# EAGLE design FET_CAP_v1.2 (EAGLE 8.2.2)
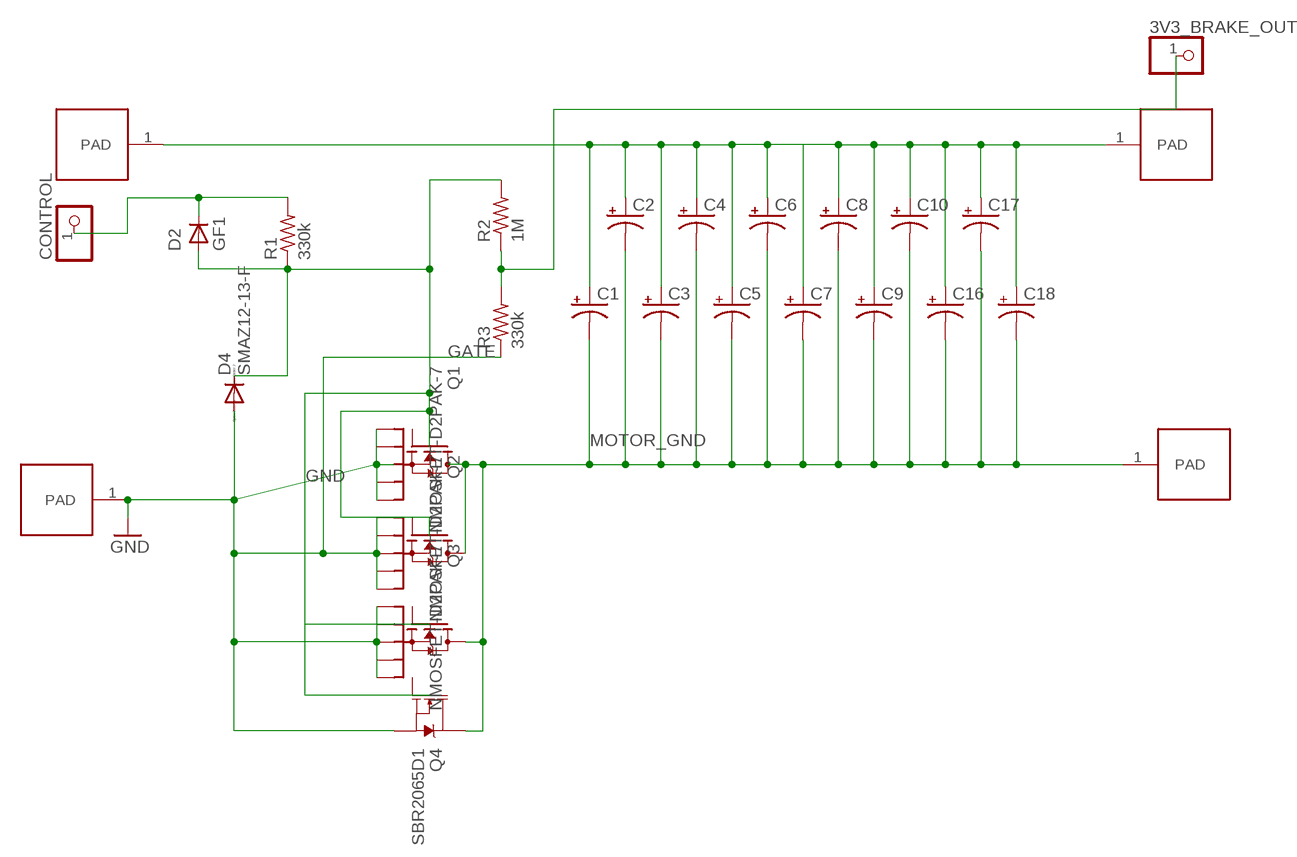
[diagram p0: schematic, sheet 1]

## Parts
3V3_BRAKE_OUT  PINHD-1X1  [1X01]
C1  CPOL-USE3.5-8  [E3,5-8]
C2  CPOL-USE3.5-8  [E3,5-8]
C3  CPOL-USE3.5-8  [E3,5-8]
C4  CPOL-USE3.5-8  [E3,5-8]
C5  CPOL-USE3.5-8  [E3,5-8]
C6  CPOL-USE5-13  [E5-13]
C7  CPOL-USE5-13  [E5-13]
C8  CPOL-USE5-13  [E5-13]
C9  CPOL-USE5-13  [E5-13]
C10  CPOL-USE5-13  [E5-13]
C16  CPOL-USE5-13  [E5-13]
C17  CPOL-USE5-13  [E5-13]
C18  CPOL-USE5-13  [E5-13]
CONTROL  PINHD-1X1  [1X01]
D2  GF1  [SMA-DO214AC]
D4  SMAZ12-13-F  DIODE-DO-214AC  [DO-214AC]
Q1  NMOSFET-D2PAK-7  [D2PAK-7]
Q2  NMOSFET-D2PAK-7  [D2PAK-7]
Q3  NMOSFET-D2PAK-7  [D2PAK-7]
Q4  SBR2065D1  MOSFET-NCH-FDD8780  [DPAK]
R1  330k  R-US_R0603  [R0603]
R2  1M  R-US_R0603  [R0603]
R3  330k  R-US_R0603  [R0603]
U$1  WIRE_SOLDER_PAD  [SOLDER_PAD]
U$2  WIRE_SOLDER_PAD  [SOLDER_PAD]
U$3  WIRE_SOLDER_PAD  [SOLDER_PAD]
U$4  WIRE_SOLDER_PAD  [SOLDER_PAD]

## Nets
3.3V_OUT: 3V3_BRAKE_OUT.1 R2.1 R3.2
GATE: D2.A D4.C R1.1 R2.2
GND: D4.A Q1.S1 Q1.S2 Q1.S3 Q1.S4 Q1.S5 Q2.S1 Q2.S5 Q3.S1 Q3.S5 Q4.3(S) R3.1 U$4.1(PAD)
MOTOR_GND [power]: C1.- C2.- C3.- C4.- C5.- C6.- C7.- C8.- C9.- C10.- C16.- C17.- C18.- Q1.D Q2.D Q3.D Q4.4(D) U$3.1(PAD)
N$2: CONTROL.1 D2.K(C) R1.2
V_BATT [power]: C1.+ C2.+ C3.+ C4.+ C5.+ C6.+ C7.+ C8.+ C9.+ C10.+ C16.+ C17.+ C18.+ U$1.1(PAD) U$2.1(PAD)
Unconnected: Q1.G Q2.G Q2.S2 Q2.S3 Q2.S4 Q3.G Q3.S2 Q3.S3 Q3.S4 Q4.1(G)

## Library data of the parts
3V3_BRAKE_OUT CONTROL = pinhead:PINHD-1X1: PIN HEADER
C1-C10 C16-C18 = rcl:CPOL-US: POLARIZED CAPACITOR, American symbol
D2 = diode:GF1: DIODE
D4 = diode:DIODE-: DIODE
Q1-Q3 = D2PAK-7:NMOSFET-D2PAK-7
Q4 = SparkFun-DiscreteSemi:MOSFET-NCH: N-channel MOSFETs Voltage controlled devices that allow control of high current outputs. SparkFun Products: SparkFun OpenScale <https://www.sparkfun.com/products/13261> SparkFun Digital Sandbox <https://www.sparkfun.com/products/12651> SparkFun Monster Moto Shield <https://www.sparkfun.com/products/10182> SparkFun MOSFET Power Controller <https://www.sparkfun.com/products/11214>; PROD_ID: TRANS-09984; VALUE: 35A/25V/8.5mΩ
R1-R3 = rcl:R-US_: RESISTOR, American symbol
U$1-U$4 = ISCTRainingProgram:WIRE_SOLDER_PAD

## Net classes
1 power: width 1.016 mm

## Board
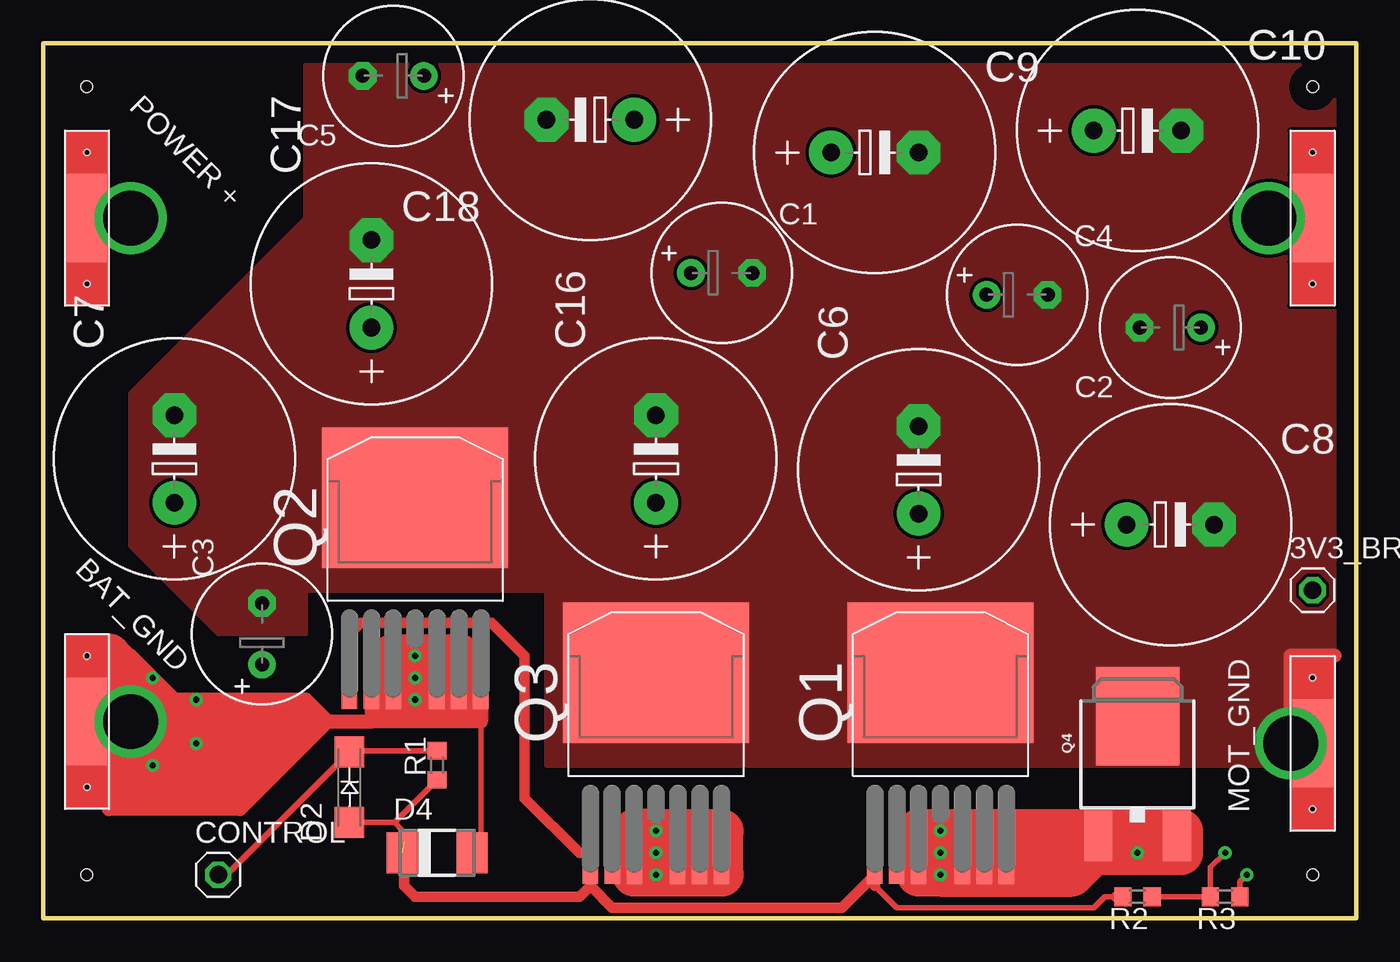
[diagram p1: board, top side]
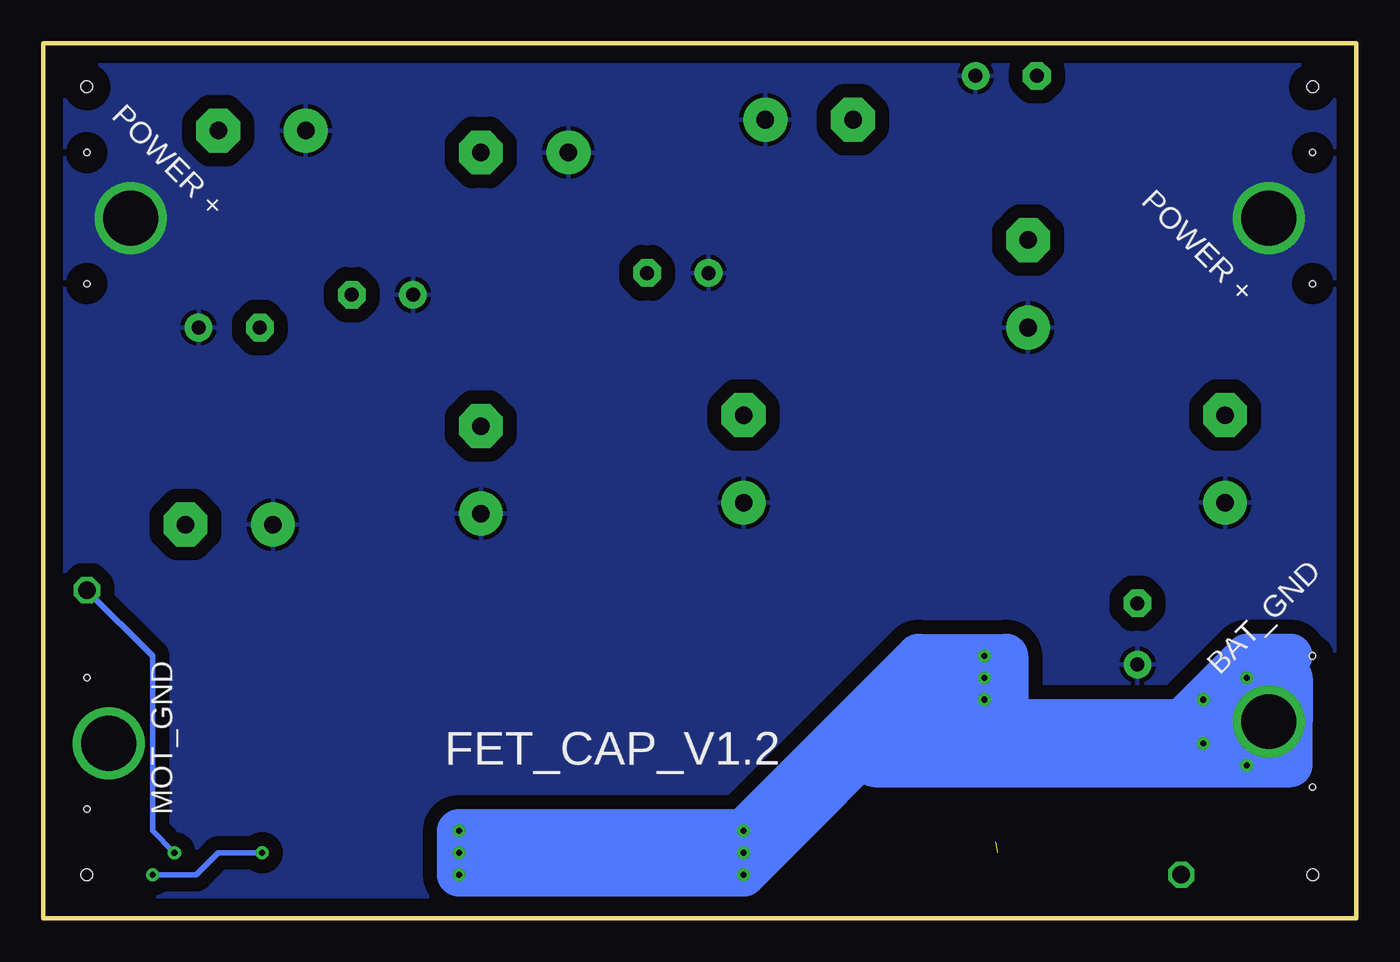
[diagram p2: board, bottom side, seen from below]

Size 76.2 x 50.8 mm. Coordinates in mm from the lower left corner, seen from the top.
Outline: 0,0 0,50.8 76.2,50.8 76.2,0 0,0
Copper layers (1*16): Top 0.035mm / dielectric 1.5mm / Bottom 0.035mm
Design rules "default": minimum track width 10mil, minimum drill 24mil, track to track 8mil, track to pad 8mil, pad to pad 8mil, via to via 8mil, smd to smd 8mil, copper to edge 40mil, drill to drill 8mil, minimum pad ring 10mil, minimum via ring 8mil, stop-mask expansion 4mil, vias tented up to drill 0mil, thermal gap 10mil
Holes 0.65 mm at 2.54,2.54 73.66,2.54 73.66,48.26 2.54,48.26

### Footprints (pad centres in the part's own frame; a part is rotated, then mirrored left to right if it is on the bottom)
1X01 = drill 1.016 octagon: 1 0,0
E3,5-8 = drill 0.813 pad 1.6: + -1.778,0 | drill 0.813 pad 1.6 octagon: - 1.778,0
E5-13 = drill 1.016 pad 2.54: + -2.54,0 | drill 1.016 pad 2.54 octagon: - 2.54,0
SMA-DO214AC = smd 1.8 x 1.7: A -2.05,0; K 2.05,0
DO-214AC = smd 1.8 x 2.4: A 2.025,0; C -2.025,0
D2PAK-7 = smd 10.8 x 8.15: D 0,4.1 | smd 0.9 x 3.2: G -3.81,-6.56; S1 -2.54,-6.56; S2 -1.27,-6.56; S3 1.27,-6.56; S4 2.54,-6.56; S5 3.81,-6.56
DPAK = smd 1.6 x 3: 1 -2.28,-5.31; 3 2.28,-5.31 | smd 4.826 x 5.715: 4 0,1.588
R0603 = smd 1 x 1.1: 1 -0.85,0; 2 0.85,0
SOLDER_PAD = smd 5.08 x 2.54: 1 3.81,2.54 | hole 0.35: 0,2.54; 7.62,2.54

### Placement (x,y rotation side)
3V3_BRAKE_OUT  73.66,19.05 0 top
C1  39.37,37.47 0 top
C2  65.41,34.29 180 top
C3  12.7,16.51 90 top
C4  56.52,36.2 0 top
C5  20.32,48.9 180 top
C6  50.8,26.04 90 top
C7  7.62,26.67 90 top
C8  65.41,22.86 0 top
C9  48.26,44.45 0 top
C10  63.5,45.72 0 top
C16  35.56,26.67 90 top
C17  19.05,36.83 90 top
C18  31.75,46.35 180 top
CONTROL  10.16,2.54 0 top
D2  17.78,7.62 90 top
D4  22.86,3.81 0 top
Q1  52.07,10.16 0 top
Q2  21.59,20.32 0 top
Q3  35.56,10.16 0 top
Q4  63.5,10.16 0 top
R1  22.86,8.89 90 top
R2  63.5,1.27 180 top
R3  68.58,1.27 180 top
U$1  76.2,36.83 90 top
U$2  5.08,36.83 90 top
U$3  76.2,6.35 90 top
U$4  5.08,7.62 90 top

### Tracks (layer width: path | path; a pad name or v marks a point on that pad's centre or on a via)
3.3V_OUT  (via drill 0.35)
  Top 0.305: R2.1 R3.2 67.73,2.96 v68.58,3.81
  Bottom 0.305: 3V3_BRAKE_OUT.1 69.85,15.24 69.85,5.08 v68.58,3.81
GATE  (1 unrouted)
  Top 0.305: 20.39,5.57 D2.A | 20.39,5.57 R1.1 | D4.C 20.84,5.12 20.39,5.57 | 62.23,1.27 61.59,1.27 60.96,0.64 49.53,0.64 48.26,1.91
  Top 0.61: 20.95,4.45 20.95,1.91 21.59,1.27 31.11,1.27 31.75,1.91 | 48.26,1.91 48.26,2.54 | 48.26,3.81 48.26,2.54 | 48.26,2.54 46.35,0.64 33.02,0.64 31.75,1.91 | 31.75,1.91 31.75,3.81 31.11,3.81 27.94,6.99 27.94,15.24 26.04,17.14 18.41,17.14 17.78,16.51 17.78,12.7 | R2.2 62.23,1.27
GND  (via drill 0.35, 3.17)  (2 unrouted)
  Top 0.305: 25.4,12.92 25.4,4.33 D4.A | R3.1 69.43,2.12 v69.85,2.54 | Q4.3 64.54,4.85 v63.5,3.81 56.09,3.81 Q1.S5 Q1.S4 Q1.S3 Q1.S2 Q1.S1 | Q3.S1 Q3.S5
  Top 0.61: v21.59,13.97 21.28,14.28 21.28,15.57 20.98,15.87 19.66,15.87 19.36,15.57 19.36,14.16 19.05,13.85 Q2.S1 | v21.59,12.7 21.28,12.7 | Q2.S5 25.4,12.92 | 35.56,4.95 v35.56,3.81 | 35.56,4.95 35.69,5.08 | v35.56,5.08 35.56,4.95 | Q3.S5 39.37,2.54 | v52.07,3.81 v52.07,5.08 | U$4.1 3.79,11.43 3.81,11.41
  Top 0.813: 2.54,15.24 3.81,15.24 | 3.81,15.24 5.08,15.24 v6.35,13.97 7.62,12.7 v8.89,12.7 15.24,12.7 16.51,11.43 | 16.51,11.43 19.05,11.43 | 19.05,11.43 19.05,13.85 19.05,15.24 20.32,15.24 v21.59,15.24 24.13,15.24 25.4,15.24 25.4,12.92 25.4,11.43 19.05,11.43 | 16.51,11.43 11.43,6.35 3.81,6.35 3.81,11.41 3.81,15.24
  Top 2.54: v52.07,5.08 66.04,5.08 66.04,3.81 60.96,3.81 59.69,2.54 v52.07,2.54 | v52.07,5.08 v52.07,2.54 | v52.07,2.54 50.8,2.54 50.8,5.08 v52.07,5.08 | 20.32,15.24 24.13,15.24 24.13,12.7 21.28,12.7 20.32,12.7 20.32,13.97 | 3.81,15.24 7.62,11.43 15.24,11.43 11.43,7.62 5.08,7.62 v5.08,11.43 | 5.08,12.7 v5.08,11.43 | v5.08,11.43 7.62,8.89 10.16,8.89 11.43,10.16 v8.89,10.16 | 35.69,5.08 34.29,5.08 34.29,2.54 39.37,2.54 39.37,5.08 35.69,5.08
  Bottom 0.305: v69.85,2.54 67.31,2.54 66.04,3.81 v63.5,3.81
  Bottom 2.54: v35.56,5.08 v52.07,5.08 v52.07,2.54 v35.56,2.54 | v35.56,5.08 v35.56,2.54 | v35.56,5.08 25.4,15.24 20.32,15.24 20.32,12.7 25.4,12.7 v35.56,2.54 | 3.81,15.24 6.35,15.24 v8.89,12.7 10.16,11.43 25.4,11.43 | 27.94,8.89 v6.35,8.89 3.81,8.89 3.81,11.43 | 3.81,13.97 3.81,11.43 | 3.81,11.43 5.08,10.16 v8.89,10.16 | 26.67,10.16 v8.89,10.16 | v8.89,10.16 5.08,13.97 5.08,12.7 v6.35,11.43
MOTOR_GND  (via drill 3.17)
  Top 0.61: U$3.1 72.4,10.16 72.39,10.17
  Top 0.813: 74.93,15.24 72.39,15.24 72.39,10.17 v72.39,10.16 72.39,8.89
  pour Top (no thermals): 76.2,8.89 29.21,8.89 29.21,19.05 15.24,19.05 15.24,16.51 10.16,16.51 5.08,21.59 5.08,30.48 15.24,40.64 15.24,49.53 16.51,50.8 76.2,50.8
N$2
  Top 0.305: CONTROL.1 10.65,2.54 D2.K 17.85,9.74 R1.2
V_BATT  (via drill 3.17)
  Top 0.61: U$2.1 v5.08,40.64 | U$1.1 v71.12,40.64
  pour Bottom (isolate 0.813): 0,50.8 76.2,50.8 76.2,0 0,0

### Text on the board
tNames: POWER + | BAT_GND | MOT_GND
bNames: POWER + | POWER + | MOT_GND | BAT_GND | FET_CAP_V1.2